# EAGLE design Rotator (EAGLE 9.6.2)
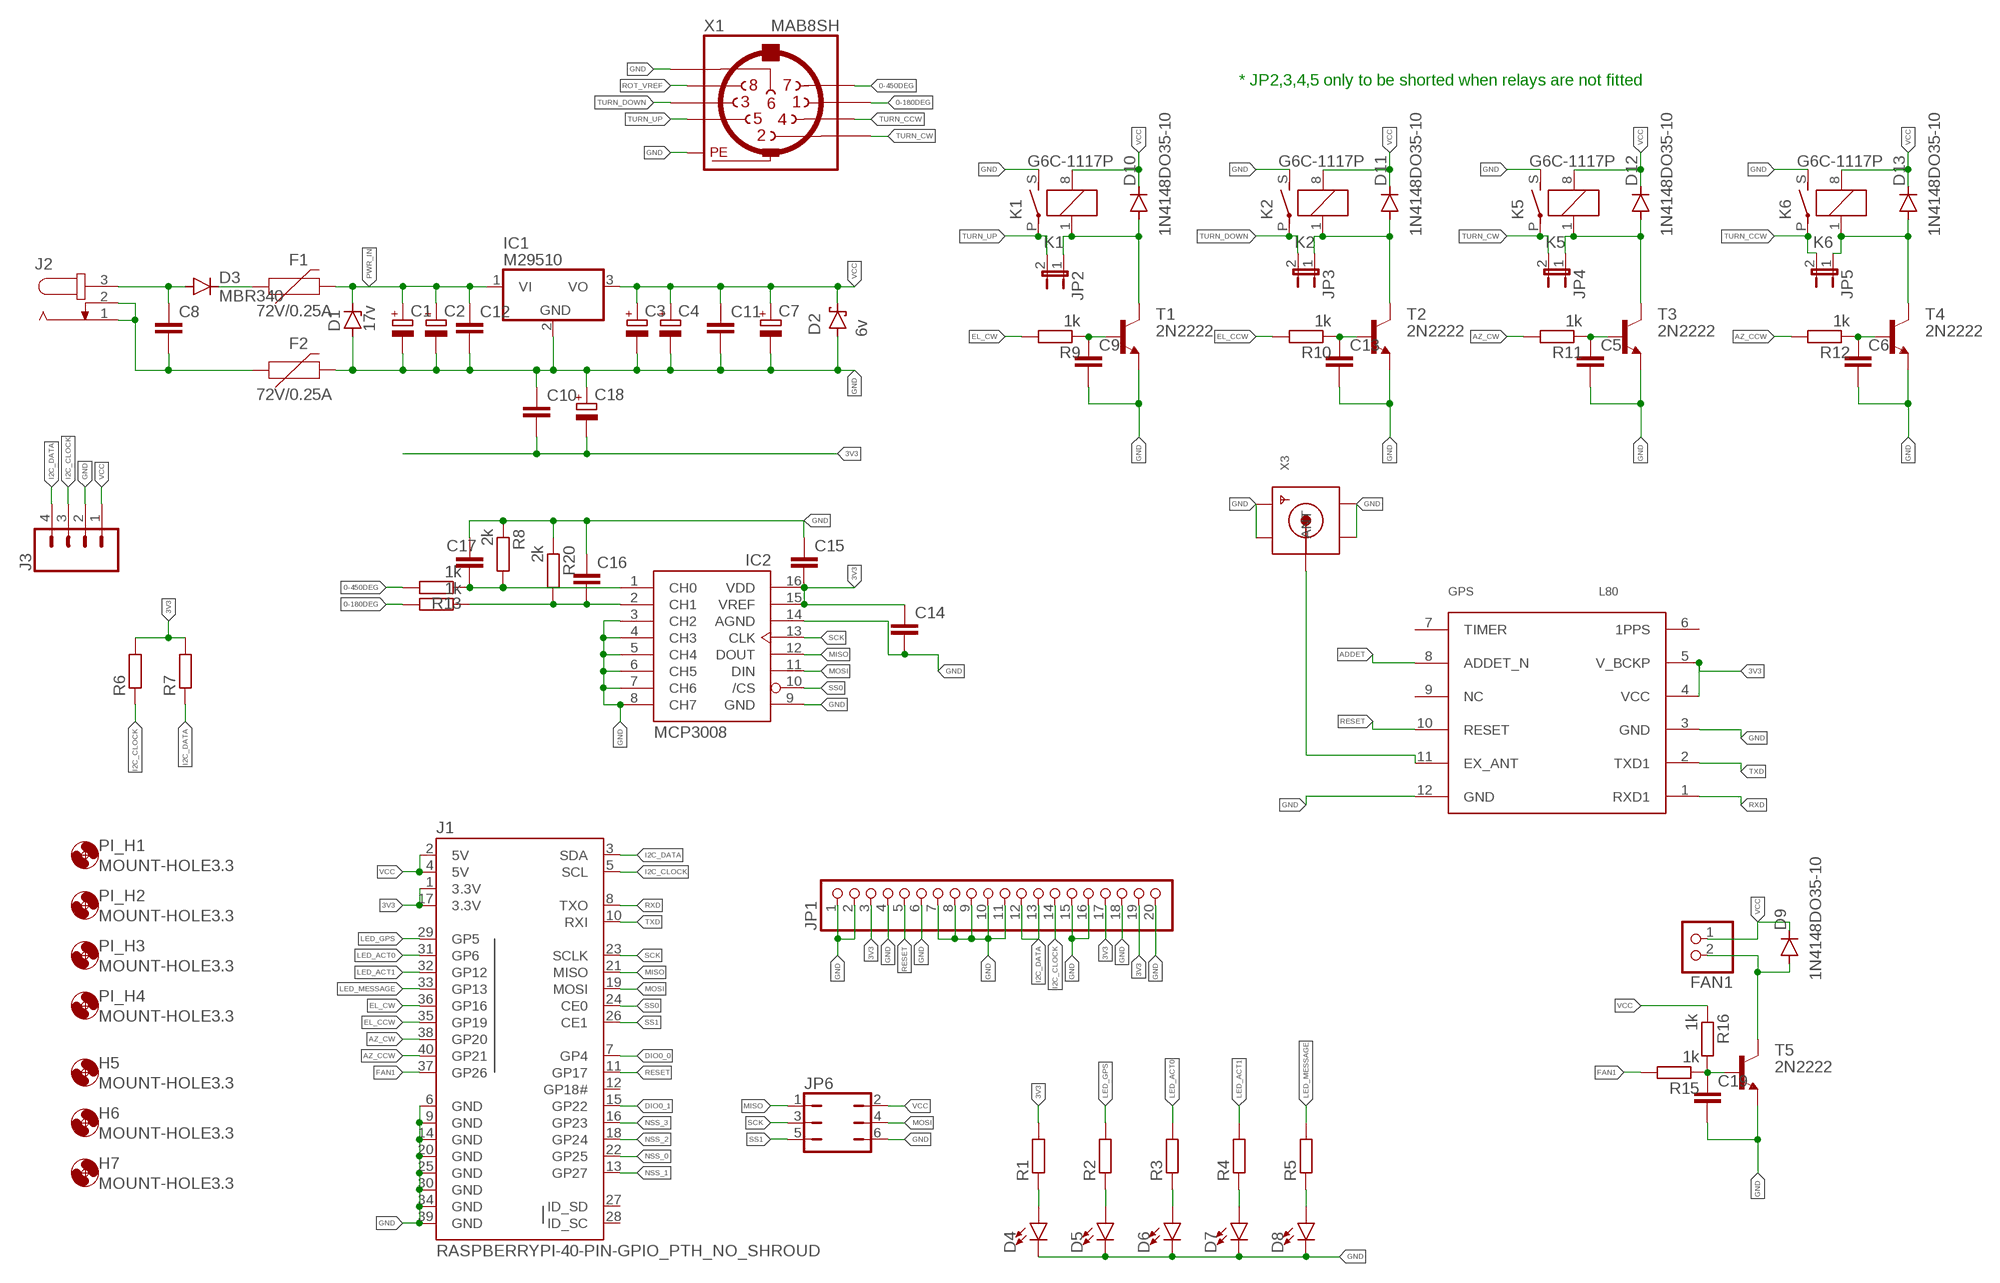
[diagram p0: schematic, sheet 1]

## Parts
C1  CPOL-EUE5-8.5  [E5-8,5]
C2  CPOL-EUE5-8.5  [E5-8,5]
C3  CPOL-EUE2.5-7  [E2,5-7]
C4  CPOL-EUE2.5-7  [E2,5-7]
C5  C-EU050-025X075  [C050-025X075]
C6  C-EU050-025X075  [C050-025X075]
C7  CPOL-EUE2.5-7  [E2,5-7]
C8  C-EU050-025X075  [C050-025X075]
C9  C-EU050-025X075  [C050-025X075]
C10  C-EU050-025X075  [C050-025X075]
C11  C-EU050-025X075  [C050-025X075]
C12  C-EU050-025X075  [C050-025X075]
C13  C-EU050-025X075  [C050-025X075]
C14  C-EU050-025X075  [C050-025X075]
C15  C-EU050-025X075  [C050-025X075]
C16  C-EU050-025X075  [C050-025X075]
C17  C-EU050-025X075  [C050-025X075]
C18  CPOL-EUE2.5-7  [E2,5-7]
C19  C-EU050-025X075  [C050-025X075]
D1  17v  ZENER-DIODEF126-12  [F126Z12]
D2  6v  SCHOTTKY-DIODEF126Z12  [F126Z12]
D3  MBR340  1N5400  [DO201-15]
D4  LED3MM  [LED_3MM]
D5  LED3MM  [LED_3MM]
D6  LED3MM  [LED_3MM]
D7  LED3MM  [LED_3MM]
D8  LED3MM  [LED_3MM]
D9  1N4148DO35-10  [DO35-10]
D10  1N4148DO35-10  [DO35-10]
D11  1N4148DO35-10  [DO35-10]
D12  1N4148DO35-10  [DO35-10]
D13  1N4148DO35-10  [DO35-10]
F1  72V/0.25A  PPTC_PTH  [PTH]
F2  72V/0.25A  PPTC_PTH  [PTH]
FAN1  JST_2PIN-THM  [JST-PH-2-THM]
GPS  L80  [L80]
H5  MOUNT-HOLE3.3  [3,3]
H6  MOUNT-HOLE3.3  [3,3]
H7  MOUNT-HOLE3.3  [3,3]
IC1  M29510  7805T  [TO220H]
IC2  MCP3008  [DIL16]
J1  RASPBERRYPI-40-PIN-GPIO_PTH_NO_SHROUD  [2X20]
J2  JACK-PLUG0  [SPC4077]
J3  CONN_04  [1X04]
JP1  PINHD-1X20  [1X20]
JP2  JP1E  [JP1]
JP3  JP1E  [JP1]
JP4  JP1E  [JP1]
JP5  JP1E  [JP1]
JP6  JP3Q  [JP3Q]
K1  G6C-1117P  [G6C-1117P]
K2  G6C-1117P  [G6C-1117P]
K5  G6C-1117P  [G6C-1117P]
K6  G6C-1117P  [G6C-1117P]
PI_H1  MOUNT-HOLE3.3  [3,3]
PI_H2  MOUNT-HOLE3.3  [3,3]
PI_H3  MOUNT-HOLE3.3  [3,3]
PI_H4  MOUNT-HOLE3.3  [3,3]
R1  R-EU_0207/10  [0207/10]
R2  R-EU_0207/10  [0207/10]
R3  R-EU_0207/10  [0207/10]
R4  R-EU_0207/10  [0207/10]
R5  R-EU_0207/10  [0207/10]
R6  R-EU_0207/10  [0207/10]
R7  R-EU_0207/10  [0207/10]
R8  2k  R-EU_0207/10  [0207/10]
R9  1k  R-EU_0207/10  [0207/10]
R10  1k  R-EU_0207/10  [0207/10]
R11  1k  R-EU_0207/10  [0207/10]
R12  1k  R-EU_0207/10  [0207/10]
R13  1k  R-EU_0207/10  [0207/10]
R14  1k  R-EU_0207/10  [0207/10]
R15  1k  R-EU_0207/10  [0207/10]
R16  1k  R-EU_0207/10  [0207/10]
R20  2k  R-EU_0207/10  [0207/10]
T1  2N2222  [TO92-EBC-OVAL]
T2  2N2222  [TO92-EBC-OVAL]
T3  2N2222  [TO92-EBC-OVAL]
T4  2N2222  [TO92-EBC-OVAL]
T5  2N2222  [TO92-EBC-OVAL]
X1  MAB8SH  [MAB8SH]
X3  SMACONNECTOR_EDGE  [SMA_EDGELAUNCH]

## Nets
0-180DEG: R14.2 X1.1
0-450DEG: R13.2 X1.7
3V3 [power]: C10.2 C14.1 C15.2 C18.- GPS.4(VCC) GPS.5(V_BCKP) IC2.15(VREF) IC2.16(VDD) J1.1(3.3V) J1.17(3.3V) JP1.3 JP1.17 JP1.19 R1.2 R6.2 R7.2
ADDET: GPS.8(ADDET_N)
AZ_CCW [power]: J1.40(GP21) R12.2
AZ_CW: J1.38(GP20) R11.2
DIO0_0: J1.7(GP4)
DIO0_1: J1.15(GP22)
EL_CCW: J1.35(GP19) R10.2
EL_CW: J1.36(GP16) R9.2
FAN1: J1.37(GP26) R15.2
FANHDR- [power]: D9.A FAN1.2 T5.C
GND [gndflood]: C1.- C2.- C3.- C4.- C5.2 C6.2 C7.- C9.2 C10.1 C11.2 C12.2 C13.2 C14.2 C15.1 C16.1 C17.1 C18.+ C19.2 D1.A D2.A D4.K(C) D5.K(C) D6.K(C) D7.K(C) D8.K(C) F2.P$2 GPS.3(GND) GPS.12(GND) IC1.2(GND) IC2.3(CH2) IC2.4(CH3) IC2.5(CH4) IC2.6(CH5) IC2.7(CH6) IC2.8(CH7) IC2.9(GND) IC2.14(AGND) J1.6(GND) J1.9(GND) J1.14(GND) J1.20(GND) J1.25(GND) J1.30(GND) J1.34(GND) J1.39(GND) J3.2 JP1.1 JP1.2 JP1.4 JP1.6 JP1.7 JP1.8 JP1.9 JP1.10 JP1.11 JP1.15 JP1.16 JP1.18 JP1.20 JP6.6 K1.S(2:S) K2.S(2:S) K5.S(2:S) K6.S(2:S) R8.1 R20.1 T1.E T2.E T3.E T4.E T5.E X1.6 X1.PE X1.PE@(PE) X3.GND@1(GND4) X3.GND@2(GND3) X3.GND@3(GND2) X3.GND@4(GND1)
I2C_CLOCK: J1.5(SCL) J3.3 JP1.14 R6.1
I2C_DATA: J1.3(SDA) J3.4 JP1.12 JP1.13 R7.1
LED_ACT0: J1.31(GP6) R3.2
LED_ACT1: J1.32(GP12) R4.2
LED_GPS: J1.29(GP5) R2.2
LED_MESSAGE: J1.33(GP13) R5.2
MISO: IC2.12(DOUT) J1.21(MISO) JP6.1
MOSI: IC2.11(DIN) J1.19(MOSI) JP6.4
N$1: C5.1 R11.1 T3.B
N$2 [power]: D12.A JP4.1 K5.1 T3.C
N$3 [power]: C8.1 D3.A J2.3
N$4 [power]: C8.2 F2.P$1 J2.1 J2.2
N$5 [ant]: GPS.11(EX_ANT) X3.P(ANT)
N$6: C13.1 R10.1 T2.B
N$7 [power]: D3.C F1.P$1
N$8: C6.1 R12.1 T4.B
N$9: C19.1 R15.1 R16.2 T5.B
N$11 [power]: D13.A JP5.1 K6.1 T4.C
N$15: D4.A R1.1
N$16: D5.A R2.1
N$17: D6.A R3.1
N$18: D7.A R4.1
N$19: D8.A R5.1
N$20: C9.1 R9.1 T1.B
N$21 [power]: D10.A JP2.1 K1.1 T1.C
N$22 [power]: D11.A JP3.1 K2.1 T2.C
N$24: C17.2 IC2.1(CH0) R8.2 R13.1
N$25: C16.2 IC2.2(CH1) R14.1 R20.2
NSS_0: J1.22(GP25)
NSS_1: J1.13(GP27)
NSS_2: J1.18(GP24)
NSS_3: J1.16(GP23)
PWR_IN [power]: C1.+ C2.+ C12.1 D1.C F1.P$2 IC1.1(VI)
RESET: GPS.10(RESET) J1.11(GP17) JP1.5
ROT_VREF: X1.8
RXD: GPS.1(RXD1) J1.8(TXO)
SCK: IC2.13(CLK) J1.23(SCLK) JP6.3
SS0: IC2.10(/CS) J1.24(CE0)
SS1: J1.26(CE1) JP6.5
TURN_CCW [power]: JP5.2 K6.P(2:P) X1.4
TURN_CW [power]: JP4.2 K5.P(2:P) X1.2
TURN_DOWN [power]: JP3.2 K2.P(2:P) X1.3
TURN_UP [power]: JP2.2 K1.P(2:P) X1.5
TXD: GPS.2(TXD1) J1.10(RXI)
VCC [power]: C3.+ C4.+ C7.+ C11.1 D2.C D9.C D10.C D11.C D12.C D13.C FAN1.1 IC1.3(VO) J1.2(5V) J1.4(5V) J3.1 JP6.2 K1.8 K2.8 K5.8 K6.8 R16.1
Unconnected: GPS.6(1PPS) GPS.7(TIMER) GPS.9(NC) J1.12(GP18#) J1.27(ID_SD) J1.28(ID_SC)

## Notes on the sheet
- * JP2,3,4,5 only to be shorted when relays are not fitted

## Library data of the parts
C1-C4 C7 C18 = rcl:CPOL-EU: POLARIZED CAPACITOR, European symbol; SPICEPREFIX: C
C5 C6 C8-C17 C19 = rcl:C-EU: CAPACITOR, European symbol; SPICEPREFIX: C
D1 = diode:ZENER-DIODE: Z-Diode
D2 = diode:SCHOTTKY-DIODE: Schottky Diode
D3 = diode:1N5400: DIODE standard rectifier, 3 A, 50 V (Motorola)
D4-D8 = SparkFun-LED:LED: LED (Generic) Standard schematic elements and footprints for 5mm, 3mm, 1206, and 0603 sized LEDs. Generic LEDs with no color specified.; PROD_ID: DIO-08794
D9-D13 = diode:1N4148: DIODE high speed (Philips)
F1 F2 = SparkFun-Fuses:PPTC: Resettable Fuse PPTC Resettable Fuse. Really a sort of resistor with a polymeric positive temperature coefficient whose resistance increases dramatically with an increase in temperature. When heated by the power passing through the resistance rises causing the current to be limited, protecting the circuit. This is achieved by the transition of the polymer from a crystalline to an amorphous state where the conductive carbon separates breaking the conductive pathways found in the cool crystalline structure. When a PPTC cools back down it resumes conducting letting the circuit turn back on. SparkFun Products: SparkFun RedBoard - Programmed with Arduino <https://www.sparkfun.com/products/12757> Pro Micro - 5V/16MHz <https://www.sparkfun.com/products/12640> Arduino Pro 328 - 5V/16MHz <https://www.sparkfun.com/products/10915> MP3 Trigger <https://www.sparkfun.com/products/13720>; PROD_ID: RES-08490
FAN1 = adafruit:JST_2PIN: JST 2-Pin Connectors of various flavors SMT-RA (S2B-PH-SM4) 4UConnector #17311 SMT (B2B-PH-SM4) THM-RA (S2B-PH) THM (B2B-PH)
GPS = L80:L80
H5-H7 PI_H1-PI_H4 = holes:MOUNT-HOLE: MOUNTING HOLE with drill center marker
IC1 = adafruit:78*: Positive VOLTAGE REGULATOR Added bigger pads to the TO-92 package
IC2 = adafruit:MCP3008
J1 = SparkFun-Connectors:RASPBERRYPI-40-PIN-GPIO: Raspberry Pi GPIO Header 2x20 pin connector, as found on B, B+, A+ models. Both shrouded PTH and SMT versions available. SparkFun Products: GPIO Shrouded Header <https://www.sparkfun.com/products/13054>- PTH SparkFun Pi Wedge (Preassembled) <https://www.sparkfun.com/products/13717>
J2 = con-jack:JACK-PLUG: DC POWER JACK Power Jack, DC, Right Angle, Through Hole, Rated 5A at 16VDC, PC Terminals Distributor: Farnell (www.Farnell.de) Drawing: 84N1161.pdf / 84N1162.pdf Manufacturer: SPC Technology (www.spctechnology.com) Type: SPC4077 / SPC 4078; OC_FARNELL: unknown; OC_NEWARK: unknown
J3 = SparkFun-Connectors:CONN_04: Multi connection point. Often used as Generic Header-pin footprint for 0.1 inch spaced/style header connections On any of the 0.1 inch spaced packages, you can populate with these: Break Away Headers - Straight <https://www.sparkfun.com/products/116> (PRT-00116) Break Away Male Headers - Right Angle <https://www.sparkfun.com/products/553> (PRT-00553) Female Headers <https://www.sparkfun.com/products/115> (PRT-00115) Break Away Headers - Machine Pin <https://www.sparkfun.com/products/117> (PRT-00117) Break Away Female Headers - Swiss Machine Pin <https://www.sparkfun.com/products/743> (PRT-00743) For SCREWTERMINALS and SPRING TERMINALS visit here: Screw Terimnals on SparkFun.com <https://www.sparkfun.com/search/results?term=Screw+Terminals> (5mm/3.5mm/2.54mm spacing) This device is also useful as a general connection point to wire up your design to another part of your project. Our various solder wires solder well into these plated through hole pads. Hook-Up Wire - Assortment (Stranded, 22 AWG) <https://www.sparkfun.com/products/11375> (PRT-11375) Hook-Up Wire - Assortment (Solid Core, 22 AWG) <https://www.sparkfun.com/products/11367> (PRT-11367) View the entire wire category on our website here <https://www.sparkfun.com/categories/141> Special notes: Molex polarized connector foot print use with SKU : PRT-08231 with associated crimp pins and housings. 1MM SMD Version SKU: PRT-10208; PROD_ID: CONN-09696
JP1 = adafruit:PINHD-1X20: PIN HEADER
JP2-JP5 = jumper:JP1E: JUMPER
JP6 = jumper:JP3Q: JUMPER
K1 K2 K5 K6 = relay:G6C-1117P: RELAY 1 x norm. open, 10 A/240 V, Omron; OC_FARNELL: unknown; OC_NEWARK: unknown
R1-R16 R20 = rcl:R-EU_: RESISTOR, European symbol; SPICEPREFIX: R
T1-T5 = adafruit:2N2222: NPN TRANSISTOR Big oval pads
X1 = con-hirschmann:MAB8SH: Female CONNECTOR 8 pins with shield, horizontal (DIN 41524); MF: FARNELL; MPN: MAB 8 SH; OC_FARNELL: 809913; OC_NEWARK: 67C7888
X3 = adafruit:SMACONNECTOR: SMA Connector 90° DIP SMA Connector, 50 Ohm (4UConnector: 07259)

## Net classes
1 power: width 1.016 mm
2 ant: width 0.635 mm, clearance 0.508 mm
4 powerfat: width 1.143 mm

## Board
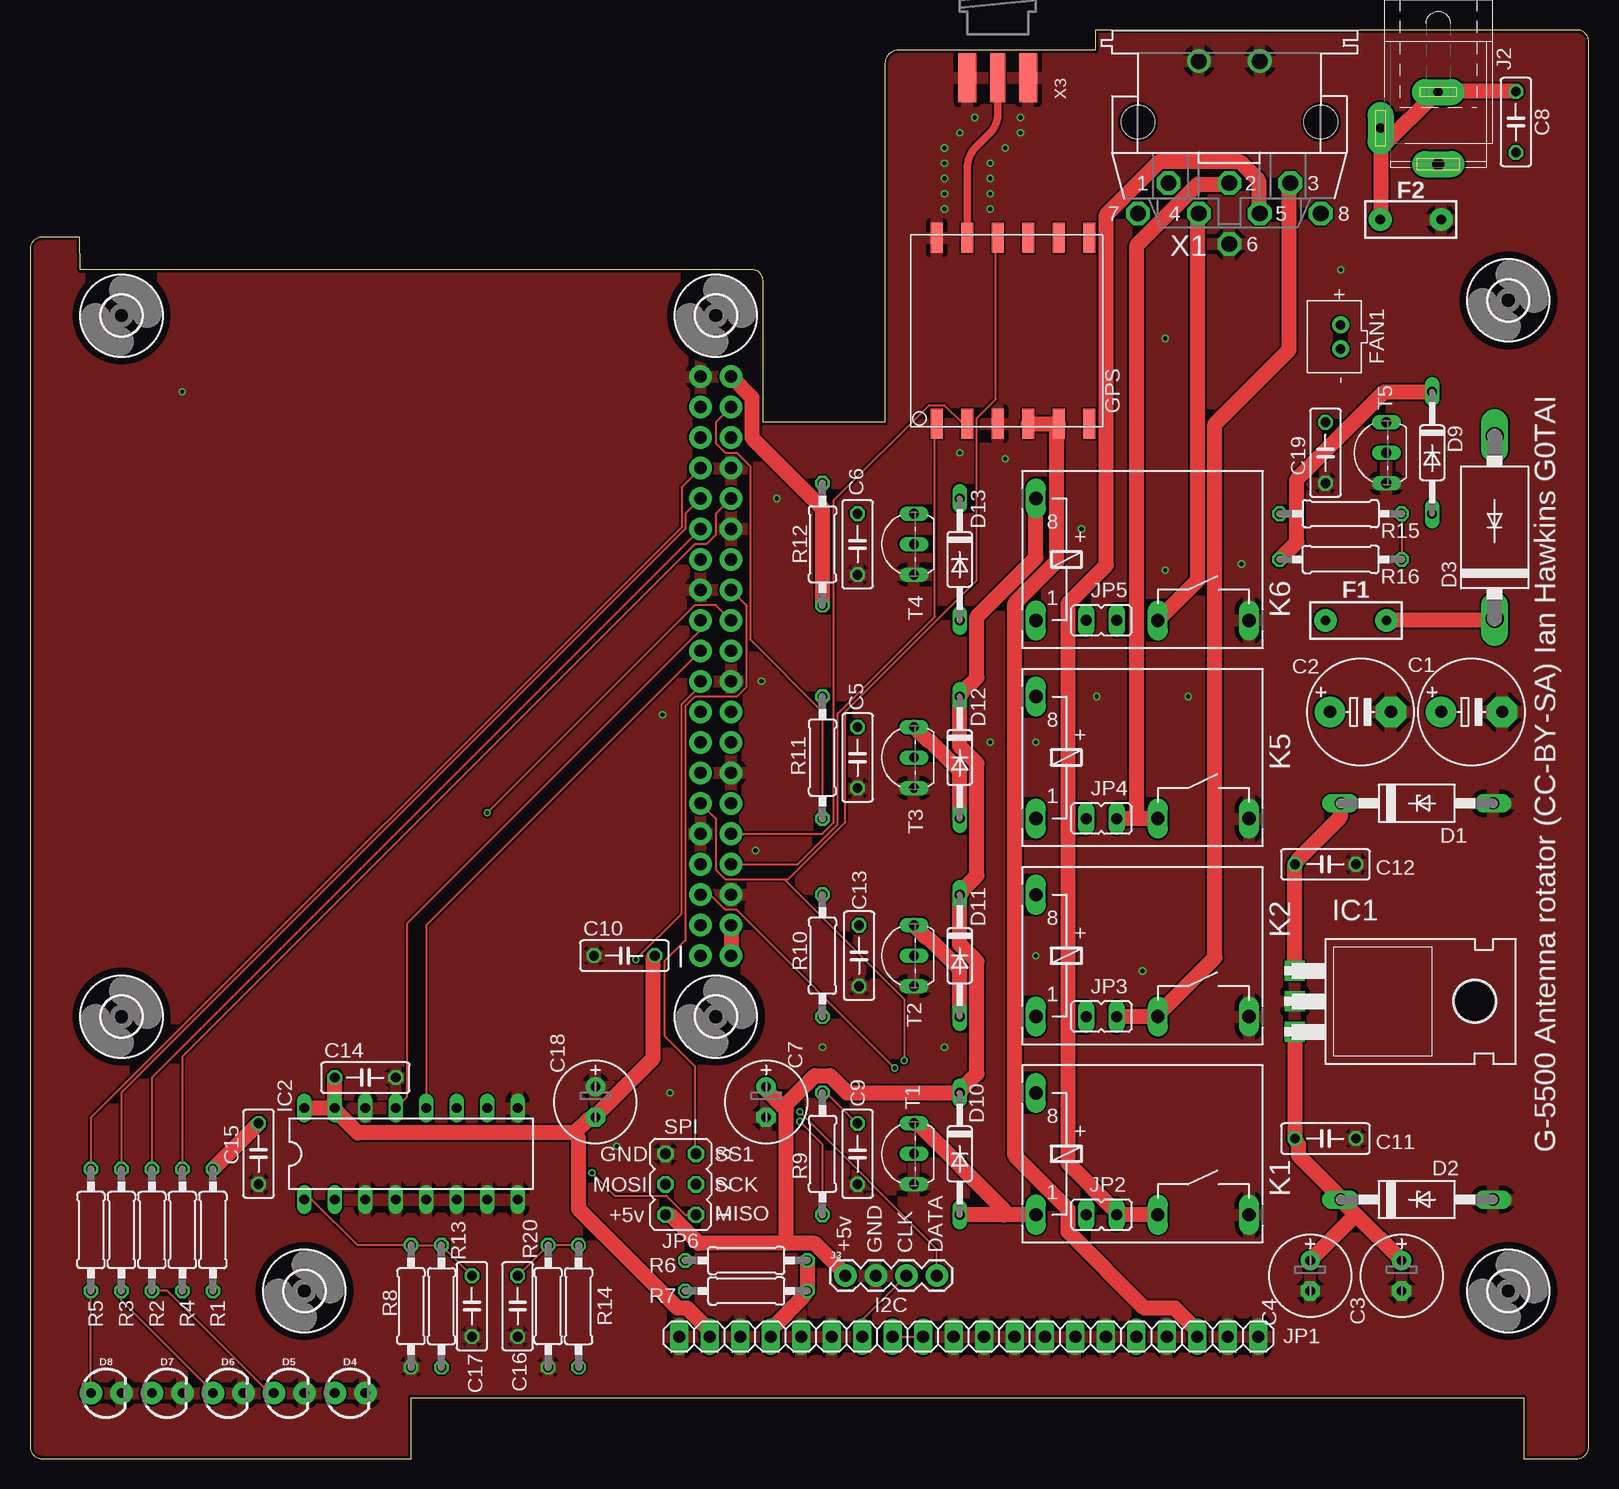
[diagram p1: board, top side]
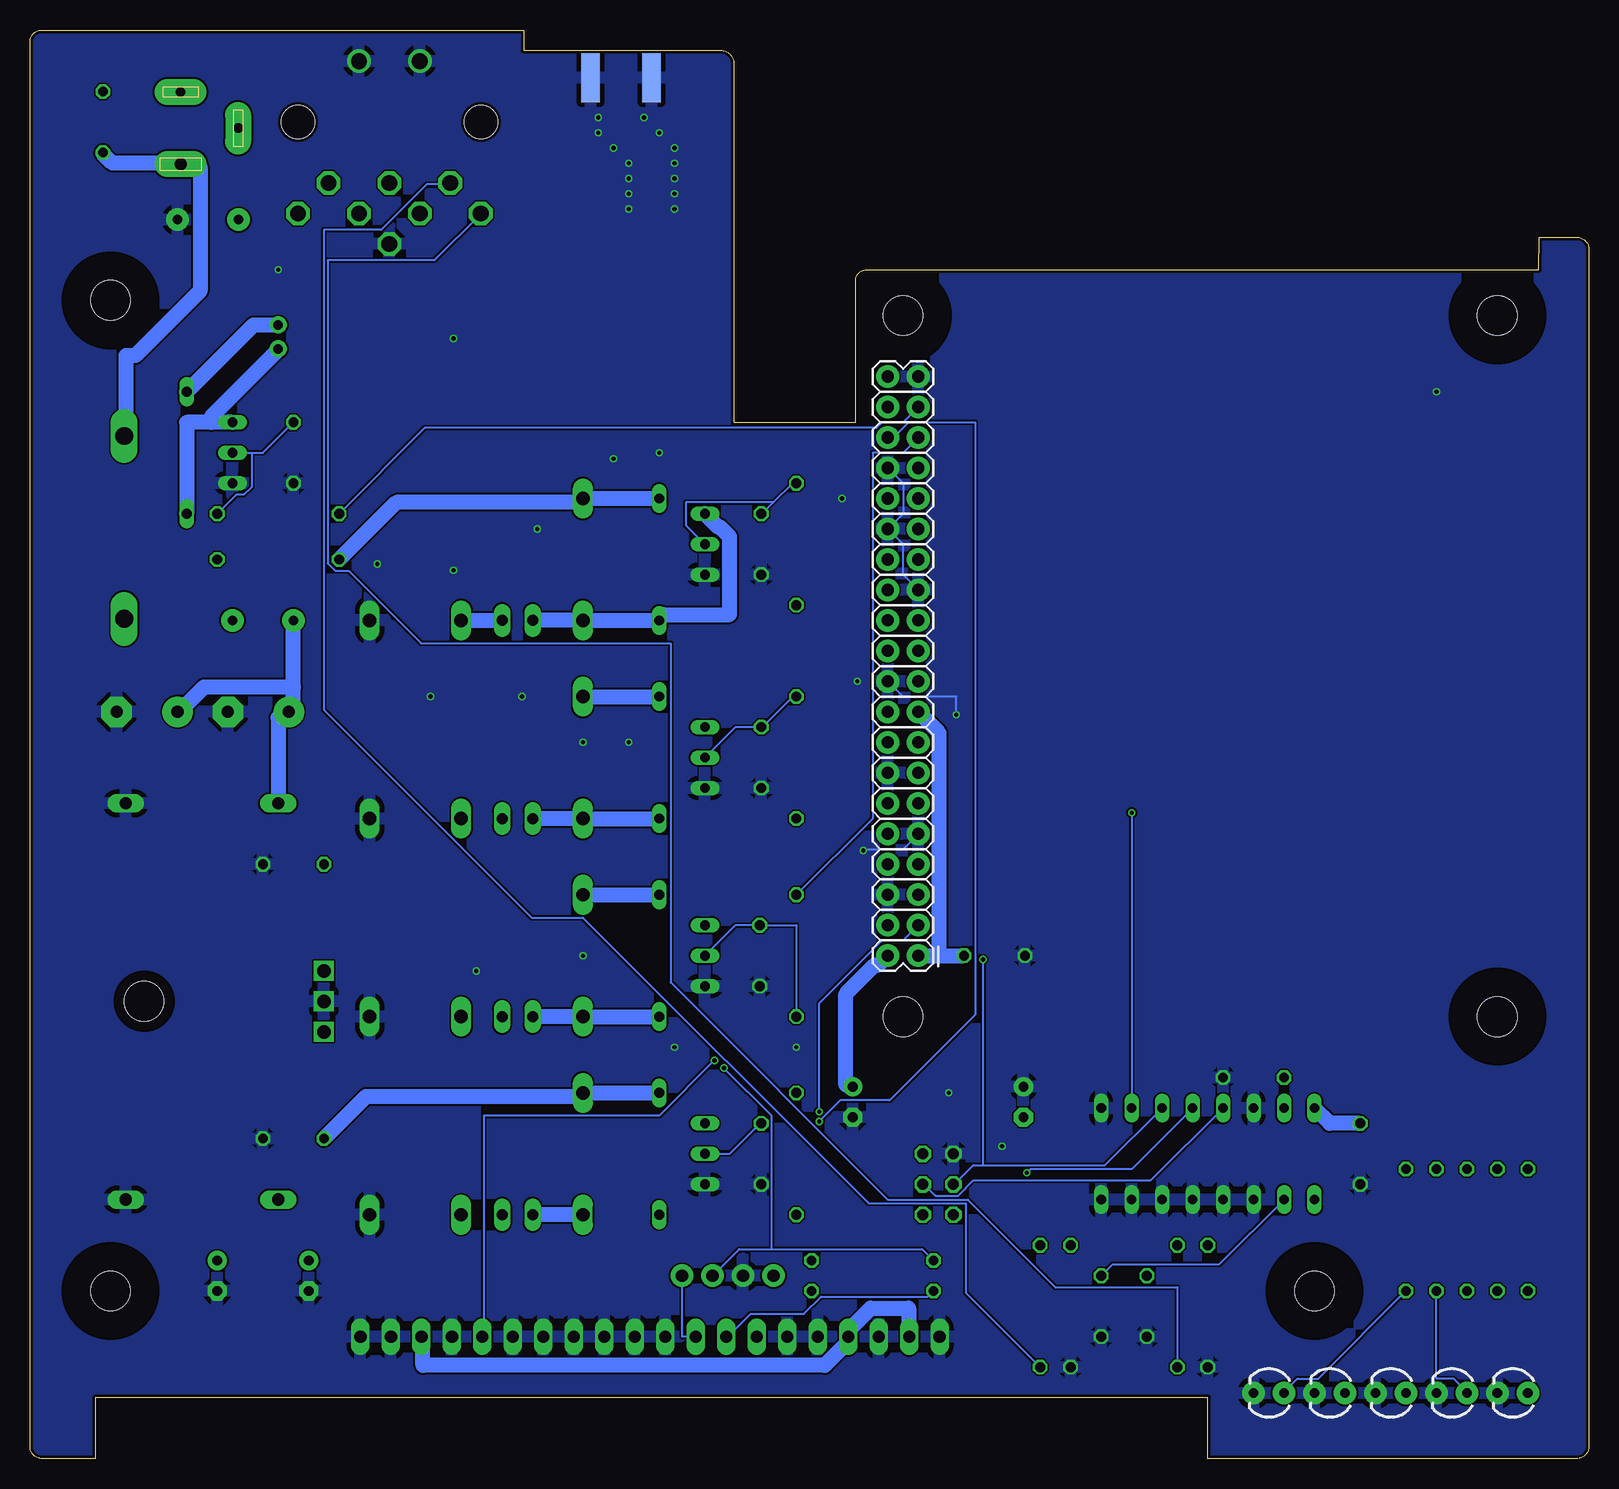
[diagram p2: board, bottom side, seen from below]

Size 129.9 x 119.05 mm. Coordinates in mm from the lower left corner, seen from the top.
Outline: 0,100.78 0,1 arc90 1,0 31.75,0 31.75,5.08 124.46,5.08 124.46,0 128.9,0 arc90 129.9,1 129.9,118.05 arc90 128.9,119.05 88.77,119.05 88.77,117.35 72.32,117.35 arc90 71.25,116.27 71.25,86.36 61.09,86.36 61.09,98.19 arc90 60.22,99.06 4.19,99.06 4.14,101.78 1,101.78 arc90 0,100.78
Copper layers (1*16): Top 0.018mm / dielectric 1.55mm / Bottom 0.018mm
Design rules "eC_2Layer_PClass6_BaseCopperO18_eCDefault *": minimum track width 0.15mm, minimum drill 0.35mm, track to track 0.15mm, track to pad 0.15mm, pad to pad 0.15mm, via to via 0.15mm, smd to smd 0mil, copper to edge 0.25mm, drill to drill 0.35mm, minimum pad ring 0.175mm, minimum via ring 0.125mm, stop-mask expansion 0mil, vias tented up to drill 0.45mm, thermal gap 0.4mm
tKeepout: area 0,-16.8 to 1.9,121.9; area 128,-3.8 to 130.8,120.5
bKeepout: area 0,-16.6 to 1.8,121.9; area 128,-3.8 to 130.8,120.4
vRestrict: area 72.9,85.1 to 90.7,102.9

### Footprints (pad centres in the part's own frame; a part is rotated, then mirrored left to right if it is on the bottom)
E5-8,5 = drill 1.016 pad 2.54: + -2.54,0 | drill 1.016 pad 2.54 octagon: - 2.54,0
E2,5-7 = drill 0.813 pad 1.6: + -1.27,0 | drill 0.813 pad 1.6 octagon: - 1.27,0
C050-025X075 = drill 0.813 octagon: 1 -2.54,0; 2 2.54,0
F126Z12 = drill 1.016 long: A 6.35,0; C -6.35,0
DO201-15 = drill 1.499 long: A 7.62,0; C -7.62,0
LED_3MM = drill 0.813 pad 1.88: A -1.27,0; K 1.27,0
DO35-10 = drill 0.813 long: A 5.08,0; C -5.08,0
PTH = drill 0.8 pad 1.88: P$1 -2.54,0; P$2 2.54,0
JST-PH-2-THM = drill 0.8 pad 1.422: 1 1,0; 2 -1,0
L80 = smd 2.5 x 1: 1 -7.75,5.85; 2 -7.75,3.31; 3 -7.75,0.77; 4 -7.75,-1.77; 5 -7.75,-4.31; 6 -7.75,-6.85; 7 7.75,-6.85; 8 7.75,-4.31; 9 7.75,-1.77; 10 7.75,0.77; 11 7.75,3.31; 12 7.75,5.85
3,3 = hole 3.3: 0,0
TO220H = drill 1.118 square: 1 -2.54,-10.16; 2 0,-10.16; 3 2.54,-10.16 | hole 3.302: 0,4.826
DIL16 = drill 0.813 long: 1 -8.89,-3.81; 2 -6.35,-3.81; 3 -3.81,-3.81; 4 -1.27,-3.81; 5 1.27,-3.81; 6 3.81,-3.81; 7 6.35,-3.81; 8 8.89,-3.81; 9 8.89,3.81; 10 6.35,3.81; 11 3.81,3.81; 12 1.27,3.81; 13 -1.27,3.81; 14 -3.81,3.81; 15 -6.35,3.81; 16 -8.89,3.81
2X20 = drill 1.016 pad 1.88: 1 0,0; 2 0,2.54; 3 2.54,0; 4 2.54,2.54; 5 5.08,0; 6 5.08,2.54; 7 7.62,0; 8 7.62,2.54; 9 10.16,0; 10 10.16,2.54; 11 12.7,0; 12 12.7,2.54; 13 15.24,0; 14 15.24,2.54; 15 17.78,0; 16 17.78,2.54; 17 20.32,0; 18 20.32,2.54; 19 22.86,0; 20 22.86,2.54; 21 25.4,0; 22 25.4,2.54; 23 27.94,0; 24 27.94,2.54; 25 30.48,0; 26 30.48,2.54; 27 33.02,0; 28 33.02,2.54; 29 35.56,0; 30 35.56,2.54; 31 38.1,0; 32 38.1,2.54; 33 40.64,0; 34 40.64,2.54; 35 43.18,0; 36 43.18,2.54; 37 45.72,0; 38 45.72,2.54; 39 48.26,0; 40 48.26,2.54
SPC4077 = drill 0.8 pad 2.184 long: 1 -3,0; 2 0,-4.8 | drill 1 pad 2.184 long: 3 3,0
1X04 = drill 1.016 pad 1.88: 1 0,0; 2 2.54,0; 3 5.08,0; 4 7.62,0
1X20 = drill 1.016 long: 1 -24.13,0; 2 -21.59,0; 3 -19.05,0; 4 -16.51,0; 5 -13.97,0; 6 -11.43,0; 7 -8.89,0; 8 -6.35,0; 9 -3.81,0; 10 -1.27,0; 11 1.27,0; 12 3.81,0; 13 6.35,0; 14 8.89,0; 15 11.43,0; 16 13.97,0; 17 16.51,0; 18 19.05,0; 19 21.59,0; 20 24.13,0
JP1 = drill 0.914 long: 1 0,-1.27; 2 0,1.27
JP3Q = drill 0.914 octagon: 1 -2.54,-1.27; 2 -2.54,1.27; 3 0,-1.27; 4 0,1.27; 5 2.54,-1.27; 6 2.54,1.27
G6C-1117P = drill 1.118 long: 1 -8.89,-5.08; 8 -8.89,5.08; P 1.27,-5.08; S 8.89,-5.08
0207/10 = drill 0.813 octagon: 1 -5.08,0; 2 5.08,0
TO92-EBC-OVAL = drill 0.813 long: B 0,-1.27; C 2.54,-1.27; E -2.54,-1.27
MAB8SH = drill 1.321 octagon: 1 5.08,5.08; 2 0,5.08; 3 -5.08,5.08; 4 2.54,7.62; 5 -2.54,7.62; 6 0,10.16; 7 7.62,7.62; 8 -7.62,7.62 | drill 1.321: PE -2.54,-5.08; PE@ 2.54,-5.08 | hole 2.794: -7.62,0; 7.62,0
SMA_EDGELAUNCH = smd 4.064 x 1.524: GND@1 2.032,-2.54; GND@2 2.032,2.54 | smd 4.064 x 1.524 bottom: GND@3 2.032,2.54; GND@4 2.032,-2.54 | smd 4.064 x 1.27: P 2.032,0

### Placement (x,y rotation side)
C1  120.14,62.23 0 top
C2  110.87,62.23 0 top
C3  114.3,15.24 270 top
C4  106.68,15.24 270 top
C5  68.96,58.42 270 top
C6  68.96,76.2 270 top
C7  61.34,29.72 270 top
C8  123.83,111.38 90 top
C9  68.96,25.4 270 top
C10  49.53,41.91 0 top
C11  107.95,26.67 0 top
C12  107.95,49.53 0 top
C13  69.09,41.91 270 top
C14  27.94,31.75 0 top
C15  19.05,25.4 90 top
C16  40.64,12.7 90 top
C17  36.83,12.7 90 top
C18  47.12,29.72 270 top
C19  107.95,83.82 270 top
D1  115.57,54.61 0 top
D2  115.57,21.59 0 top
D3  122.05,77.6 90 top
D4  26.67,5.46 0 top
D5  21.59,5.46 0 top
D6  16.51,5.46 0 top
D7  11.43,5.46 0 top
D8  6.35,5.46 0 top
D9  116.84,83.82 270 top
D10  77.47,25.4 270 top
D11  77.47,41.91 270 top
D12  77.47,58.42 270 top
D13  77.47,74.93 270 top
F1  110.49,69.85 180 top
F2  115.06,103.25 0 top
FAN1  109.22,93.47 90 top
GPS  81.41,93.98 90 top
H5  123.19,96.52 0 top
H6  123.19,13.97 0 top
H7  22.86,13.97 0 top
IC1  115.57,38.1 270 top
IC2  31.75,25.4 0 top
J1  55.88,41.91 90 bottom
J2  117.35,110.87 270 top
J3  67.94,15.24 0 top
JP1  78.23,10.16 180 top
JP2  89.28,20.32 270 top
JP3  89.28,36.83 270 top
JP4  89.28,53.34 270 top
JP5  89.28,69.85 270 top
JP6  54.23,22.86 90 top
K1  92.71,25.4 0 top
K2  92.71,41.91 0 top
K5  92.71,58.42 0 top
K6  92.71,74.93 0 top
PI_H1  57.15,36.83 0 top
PI_H2  57.15,95.25 0 top
PI_H3  7.62,36.83 0 top
PI_H4  7.62,95.25 0 top
R1  15.24,19.05 90 top
R2  10.16,19.05 90 top
R3  7.62,19.05 90 top
R4  12.7,19.05 90 top
R5  5.08,19.05 90 top
R6  59.69,16.51 0 top
R7  59.69,13.97 0 top
R8  31.75,12.7 90 top
R9  66.04,25.4 270 top
R10  66.04,41.91 90 top
R11  66.04,58.42 270 top
R12  66.04,76.2 270 top
R13  34.29,12.7 270 top
R14  45.72,12.7 270 top
R15  109.22,78.74 180 top
R16  109.22,74.93 0 top
R20  43.18,12.7 90 top
T1  72.39,25.4 90 top
T2  72.39,41.91 90 top
T3  72.39,58.42 90 top
T4  72.39,76.2 90 top
T5  111.76,83.82 90 top
X1  99.95,111.38 180 top
X3  80.64,117.09 270 top

### Tracks (layer width: path | path; a pad name or v marks a point on that pad's centre or on a via)
0-180DEG
  Bottom 0.15: R14.2 51.91,13.81 51.91,21.27 60.01,21.27 83.82,45.09 88.11,45.09 105.41,62.39 105.41,102.39 100.65,102.39 96.84,106.2 94.93,106.2 X1.1
0-450DEG
  Bottom 0.15: R13.2 34.29,14.29 44.45,14.29 51.75,21.59 58.42,21.59 76.52,39.69 76.52,67.94 97.31,67.94 103.35,73.98 104.46,73.98 105.09,74.61 105.09,99.85 96.2,99.85 92.39,103.66 X1.7
3V3
  Top 1.27: IC2.15 IC2.16 | IC2.15 C14.1 | C15.2 R1.2 | C10.2 51.91,41.75 51.91,33.34 47.15,28.57 C18.- 46.51,28.26 45.4,27.15 | 45.4,27.15 27.3,27.15 25.72,28.73 IC2.15 | GPS.4 83.19,86.2 85.57,86.2 GPS.5 85.57,85.57 85.57,74.77 82.07,71.28 82.07,25.24 86.52,20.8 86.52,18.89 92.87,12.54 95.41,12.54 97.16,10.79 97.16,10.16 JP1.3 | R6.2 R7.2 64.45,13.49 61.75,10.79 61.75,10.16 JP1.17 | 45.4,27.15 45.72,26.67 45.72,20.8 53.98,12.54 54.77,12.54 56.52,10.79 56.52,10.16 JP1.19
  Bottom 1.27: IC2.16 21.59,27.94 C15.2 | J1.1 54.13,41.91 | 54.13,41.91 C10.2 | J1.17 54.13,60.48 54.13,41.91 | JP1.19 56.67,10.16 56.67,12.54 59.85,12.54 61.59,10.79 61.59,10.16 JP1.17 61.75,9.68 63.66,7.78 97.16,7.78 97.16,10.16 JP1.3
AZ_CCW
  Top 1.27: R12.2 66.04,79.22 60.17,85.09 60.17,88.42 J1.40
AZ_CW
  Top 0.15: R11.2 66.04,62.23 60.01,68.26 60.01,82.71 58.9,83.82 57.94,83.82 57.15,84.61 57.15,86.36 J1.38
EL_CCW
  Bottom 0.15: R10.2 59.69,53.34 59.69,83.82 57.15,83.82 J1.35
EL_CW  (via drill 0.35)
  Top 0.15: R9.2 66.04,26.19 v64.14,28.1
  Bottom 0.15: v64.14,28.1 62.39,29.84 58.26,29.84 51.12,36.99 51.12,86.36 56.67,86.36 57.94,85.09 J1.36
FAN1
  Bottom 0.15: R15.2 97,85.88 59.37,85.88 58.9,86.36 57.15,86.36 J1.37
FANHDR-
  Bottom 1.27: D9.A 116.84,86.36 114.78,86.36 | T5.C 114.78,86.36 | FAN1.2 109.22,92.39 114.78,86.84 114.78,86.36
GND  (via drill 0.35)
  Bottom 0.15: J1.34 57.15,81.28 57.15,78.74 J1.30 57.15,76.2 57.15,73.66 J1.25 | J1.9 57.15,50.8 60.33,50.8 v60.45,50.67 | J1.20 57.15,63.5 52.7,63.5 v52.7,61.98
  other vias: 78.74,111.76 77.47,110.49 76.2,109.22 76.2,107.95 76.2,106.68 76.2,105.41 76.2,104.14 80.01,104.14 80.01,105.41 80.01,106.68 80.01,107.95 81.28,109.22 82.55,110.49 82.55,111.76 77.47,83.82 62.23,80.01 80.01,59.69 83.82,59.69 88.9,63.5 96.52,63.5 94.61,93.34 83.82,41.91 53.34,30.48 48.9,26.04 60.96,64.77 66.04,34.29 109.22,99.06 100.97,74.55 94.61,74.04 81.28,83.31 87.63,77.47 92.71,40.64 76.2,34.29 12.7,88.9
  pour Top: 0,120.65 0,0 130.81,0 130.81,120.65
  pour Bottom: 0,120.65 0,0 130.81,0 130.81,120.65
I2C_CLOCK  (via drill 0.35)
  Top 0.15: J3.3 69.37,11.59 69.37,10.16 JP1.14 | J1.5 56.67,46.99 57.94,45.72 58.9,45.72 v72.07,32.54
  Bottom 0.15: R6.1 55.56,17.46 68.1,17.46 | 68.1,17.46 70.8,17.46 J3.3 | v72.07,32.54 68.1,28.57 68.1,17.46
I2C_DATA  (via drill 0.35)
  Top 0.15: JP1.13 JP1.12 | v64.14,28.89 75.56,17.46 J3.4
  Bottom 0.15: R7.1 55.09,13.49 63.98,13.49 65.41,12.06 69.85,12.06 71.75,10.16 JP1.13 | J3.4 75.56,10.16 JP1.12 | J1.3 57.15,43.18 58.9,43.18 64.14,37.94 v64.14,28.89
LED_ACT0
  Top 0.15: R3.2 7.62,30.48 54.61,77.47 54.61,78.74 J1.31
LED_ACT1
  Top 0.15: R4.2 12.7,33.5 55.4,76.2 56.36,76.2 57.15,76.99 57.15,78.74 J1.32
LED_GPS
  Top 0.15: R2.2 10.16,31.75 J1.29
LED_MESSAGE
  Top 0.15: R5.2 5.08,28.42 54.29,77.63 54.29,80.96 J1.33
MISO  (via drill 0.35)
  Top 0.15: IC2.12 33.02,44.45 J1.21 | JP6.1 54.61,20.32 53.02,21.91 48.74,21.91 v46.83,23.81
  Bottom 0.15: v46.83,23.81 46.51,24.13 38.1,24.13 IC2.12
MOSI  (via drill 0.35)
  Top 0.15: J1.19 55.88,64.45 54.29,62.87 54.29,45.4 v50.48,41.59
  Bottom 0.15: IC2.11 40.32,24.45 50.48,24.45 | 50.48,24.45 51.28,24.45 52.86,22.86 JP6.4 | 50.48,24.45 v50.48,41.59
N$1
  Bottom 0.15: R11.1 66.36,63.5 68.9,60.96 C5.1 71.12,60.96 T3.B
N$2
  Top 1.27: T3.C 74.77,59.85 74.93,59.85 77.47,57.31 D12.A
  Bottom 1.27: D12.A K5.1 JP4.1
N$3
  Bottom 1.27: C8.1 123.83,108.74 123.03,107.95 117.47,107.95 J2.3 116.84,107.63 115.73,107.63 115.73,97.31 121.13,91.92 121.92,91.92 121.92,85.25 D3.A
N$4
  Top 1.27: C8.2 123.83,113.98 117.47,113.98 J2.1 116.84,113.51 113.03,109.7 J2.2 112.55,110.81 112.55,103.35 F2.P$1
N$5
  Top 0.635: X3.P 80.64,112.02 arc-45 80.01,110.49 78.84,109.32 arc45 78.1,107.53 GPS.11
N$6
  Bottom 0.15: R10.1 66.04,44.45 C13.1 71.12,44.45 T2.B
N$7
  Top 1.27: F1.P$1 121.92,69.85 D3.C
N$8
  Bottom 0.15: 67.94,79.69 66.36,81.28 R12.1 | 67.94,79.69 68.9,78.74 C6.1 | T4.B 75.25,77.79 75.25,79.69 67.94,79.69
N$9
  Top 0.15: R15.1 R16.2
  Bottom 0.15: C19.1 110.49,83.82 111.44,83.82 | T5.B 111.44,83.82 | R15.1 112.71,80.33 112.08,80.33 111.44,80.96 111.44,83.82
N$11
  Bottom 1.27: T4.C 72.55,77.63 72.39,77.63 71.6,76.83 71.6,70.33 77.15,70.33 D13.A K6.1 JP5.1
N$15
  Bottom 0.15: R1.1 22.54,6.67 24.29,6.67 25.4,5.56 D4.A
N$16
  Top 0.15: R2.1 11.43,13.97 19.84,5.56 20.32,5.56 D5.A
N$17
  Top 0.15: R3.1 7.62,13.18 15.24,5.56 D6.A
N$18
  Bottom 0.15: R4.1 12.7,6.67 11.27,6.67 10.16,5.56 D7.A
N$19
  Top 0.15: D8.A R5.1
N$20
  Top 0.15: R9.1 66.36,30.48 68.9,27.94 C9.1
  Bottom 0.15: T1.B 71.6,25.4 69.06,27.94 C9.1
N$21
  Top 1.27: K1.1 81.12,20.32 | 81.12,20.32 D10.A | T1.C 73.98,27.94 81.12,20.8 81.12,20.32
  Bottom 1.27: K1.1 JP2.1
N$22
  Top 1.27: T2.C 74.77,43.34 74.93,43.34 77.47,40.8 D11.A
  Bottom 1.27: D11.A K2.1 JP3.1
N$24
  Top 0.15: IC2.1 23.5,21.59 27.3,17.78 R8.2 R13.1 C17.2
N$25
  Top 0.15: R14.1 R20.2 C16.2
  Bottom 0.15: IC2.2 30.8,16.19 39.69,16.19 C16.2
PWR_IN
  Top 1.27: IC1.1 C12.1 105.73,50.01 109.22,53.5 D1.C
  Bottom 1.27: 107.95,64.29 107.95,62.23 C2.+ 108.74,61.75 109.22,61.75 D1.C | 107.95,64.29 F1.P$2 | 107.95,64.29 115.41,64.29 117.47,62.23 C1.+
RESET  (via drill 0.35)
  Top 0.15: 62.87,48.26 57.94,48.26 57.15,49.05 57.15,53.34 J1.11 | 62.87,48.26 63.18,48.26 67.94,53.02 67.94,62.23 78.9,73.18 78.9,86.68 80.49,88.27 80.49,101.6 GPS.10 | v72.87,33.18 72.87,38.26 62.87,48.26
  Bottom 0.15: v72.87,33.18 77.47,28.57 92.08,28.57 92.08,10.16 JP1.5
RXD
  Top 0.15: J1.8 63.98,49.53 67.31,52.86 67.31,62.07 75.41,70.17 75.41,86.2 GPS.1
SCK
  Top 0.15: J1.23 55.88,69.06 31.43,44.61 31.43,30.16 IC2.13
  Bottom 0.15: IC2.13 36.51,23.18 51.28,23.18 52.55,21.91 54.45,21.91 55.4,22.86 JP6.3
SS0  (via drill 0.35)
  Top 0.15: v38.1,53.82 55.4,71.12 57.15,71.12 J1.24
  Bottom 0.15: v38.1,53.82 IC2.10
SS1
  Top 0.15: J1.26 59.69,71.12 59.69,64.29 58.9,63.5 55.4,63.5 54.61,62.71 54.61,43.18 52.86,41.43 52.86,35.24 55.4,32.7 55.4,25.4 JP6.5
TURN_CCW
  Top 1.27: K6.P 97.31,73.18 97.31,103.66 X1.4
  Bottom 1.27: K6.P JP5.2
TURN_CW
  Top 1.27: K5.P 92.23,53.34 | 92.23,53.34 JP4.2 | 92.23,53.34 92.23,101.12 97.31,106.2 99.85,106.2 X1.2
TURN_DOWN
  Top 1.27: JP3.2 K2.P 94.3,37.31 98.74,41.75 98.74,86.2 104.93,92.39 104.93,106.2 X1.3
TURN_UP
  Top 1.27: K1.P JP2.2 90.33,20.8 86.52,24.61 86.52,71.28 89.69,74.45 89.69,103.66 94.14,108.11 100.81,108.11 102.39,106.52 102.39,103.82 X1.5
TXD
  Top 0.15: J1.10 66.04,52.07 66.99,53.02 66.99,79.85 74.93,87.79 76.2,87.79 77.63,86.36 77.95,86.36 GPS.2
VCC
  Top 1.27: D9.C 112.87,88.9 105.57,81.6 105.57,76.36 R16.1 | IC1.3 C11.1 105.73,26.19 105.73,25.24 108.9,22.07 D2.C 110.49,20.32 | C3.+ 110.49,20.32 | 110.49,20.32 C4.+ | J1.4 J1.2 | JP6.2 53.34,20.32 55.72,17.94 63.02,17.94 | 63.02,17.94 65.41,17.94 67.94,15.4 J3.1 | 62.79,29.29 63.02,29.05 63.02,17.94 | 62.79,29.29 61.44,30.64 61.44,30.96 C7.+ | 62.79,29.29 65.41,31.91 66.67,31.91 68.1,30.48 D10.C 77.79,30.96 78.9,32.07 78.9,41.43 77.47,42.86 D11.C 77.79,47.47 78.9,48.58 78.9,57.94 77.47,59.37 D12.C 77.79,63.98 78.9,65.09 78.9,70.17 83.82,75.09 K6.8
  Bottom 1.27: D9.C 111.28,94.46 109.22,94.46 FAN1.1 | D13.C K6.8 84.3,79.69 99.38,79.69 R16.1 | K5.8 D12.C | K2.8 D11.C | D10.C K1.8 84.3,30.16 101.92,30.16 C11.1 | J1.2 59.21,41.12 59.53,41.12 61.91,38.73 61.91,31.11 61.44,31.11 C7.+

### Text on the board
tNames: SPI | G-5500 Antenna rotator (CC-BY-SA) Ian Hawkins G0TAI | GND | SS1 | MOSI | SCK | +5v | MISO | +5v | GND | CLK | DATA | I2C